# Altium project printer.PrjPCB
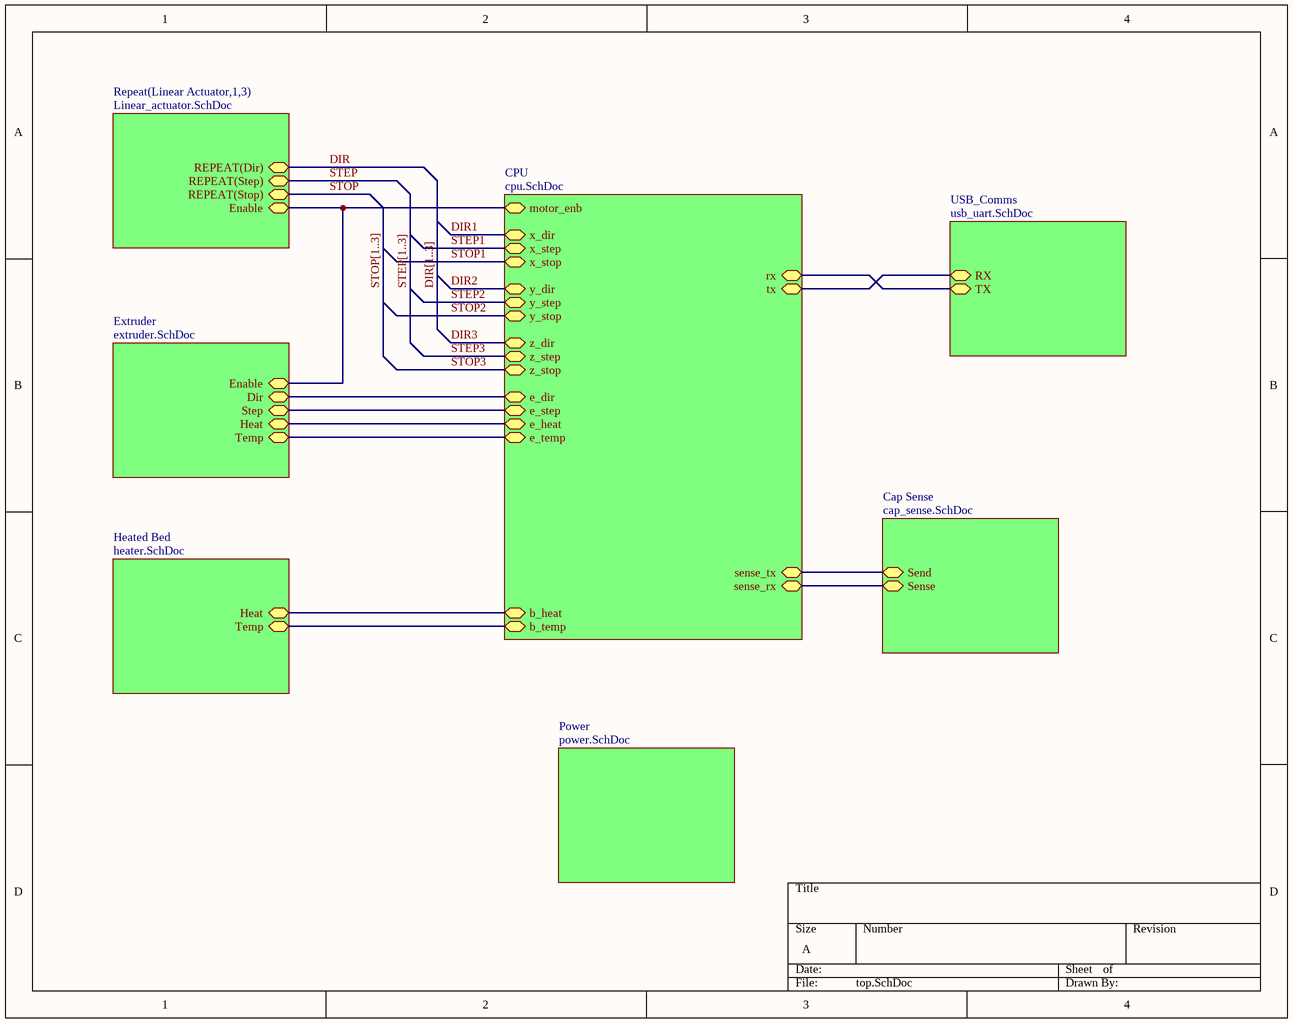
[diagram p0: top.SchDoc]
9 sheets, 136 parts. Net scope: hierarchical (ports join the sheet entries above them; power ports are global).
Board file: pcb.PcbDoc
Sheets:
  top.SchDoc
    CPU = cpu.SchDoc
    Linear Actuator1 = Linear_actuator.SchDoc
      stepper = Stepper_driver.SchDoc
    Linear Actuator2 = Linear_actuator.SchDoc
      stepper = Stepper_driver.SchDoc
    Linear Actuator3 = Linear_actuator.SchDoc
      stepper = Stepper_driver.SchDoc
    Heated Bed = heater.SchDoc
    Extruder = extruder.SchDoc
      stepper = Stepper_driver.SchDoc
      Hot End = heater.SchDoc
    Power = power.SchDoc
    USB_Comms = usb_uart.SchDoc
    Cap Sense = cap_sense.SchDoc

## Sheet top.SchDoc
size A

### Sub-sheets
Cap Sense = cap_sense.SchDoc: Sense, Send
CPU = cpu.SchDoc: x_step, x_dir, motor_enb, y_step, y_dir, z_step, z_dir, e_step, e_dir, e_heat, e_temp, b_heat, b_temp, x_stop, y_stop, z_stop, rx, tx, sense_rx, sense_tx
Extruder = extruder.SchDoc: Dir, Step, Enable, Heat, Temp
Heated Bed = heater.SchDoc: Temp, Heat
Power = power.SchDoc: no entries
Repeat(Linear Actuator,1,3) = Linear_actuator.SchDoc: REPEAT(Dir), REPEAT(Step), Enable, REPEAT(Stop)
USB_Comms = usb_uart.SchDoc: RX, TX

### Nets
DIR: sheet Repeat(Linear Actuator,1,3)/REPEAT(Dir)
STEP: sheet Repeat(Linear Actuator,1,3)/REPEAT(Step)
STOP: sheet Repeat(Linear Actuator,1,3)/REPEAT(Stop)
NetC8_Heated_Bed_1: sheet CPU/b_temp, sheet Heated Bed/Temp
NetC8_Hot_End_1: sheet CPU/e_temp, sheet Extruder/Temp
NetQ2_1: sheet CPU/sense_tx, sheet Cap Sense/Send
NetQ3_2: sheet CPU/sense_rx, sheet Cap Sense/Sense
NetR6_Heated_Bed_2: sheet CPU/b_heat, sheet Heated Bed/Heat
NetR6_Hot_End_2: sheet CPU/e_heat, sheet Extruder/Heat
NetU1_9: sheet CPU/rx, sheet USB_Comms/TX
NetU1_10: sheet CPU/tx, sheet USB_Comms/RX
NetU1_34: sheet CPU/e_step, sheet Extruder/Step
NetU1_35: sheet CPU/motor_enb, sheet Repeat(Linear Actuator,1,3)/Enable, sheet Extruder/Enable
NetU1_36: sheet CPU/e_dir, sheet Extruder/Dir

### Buses and harness runs
bus DIR[1..3]
bus STEP[1..3]
bus STOP[1..3]

## Sheet cpu.SchDoc
size A
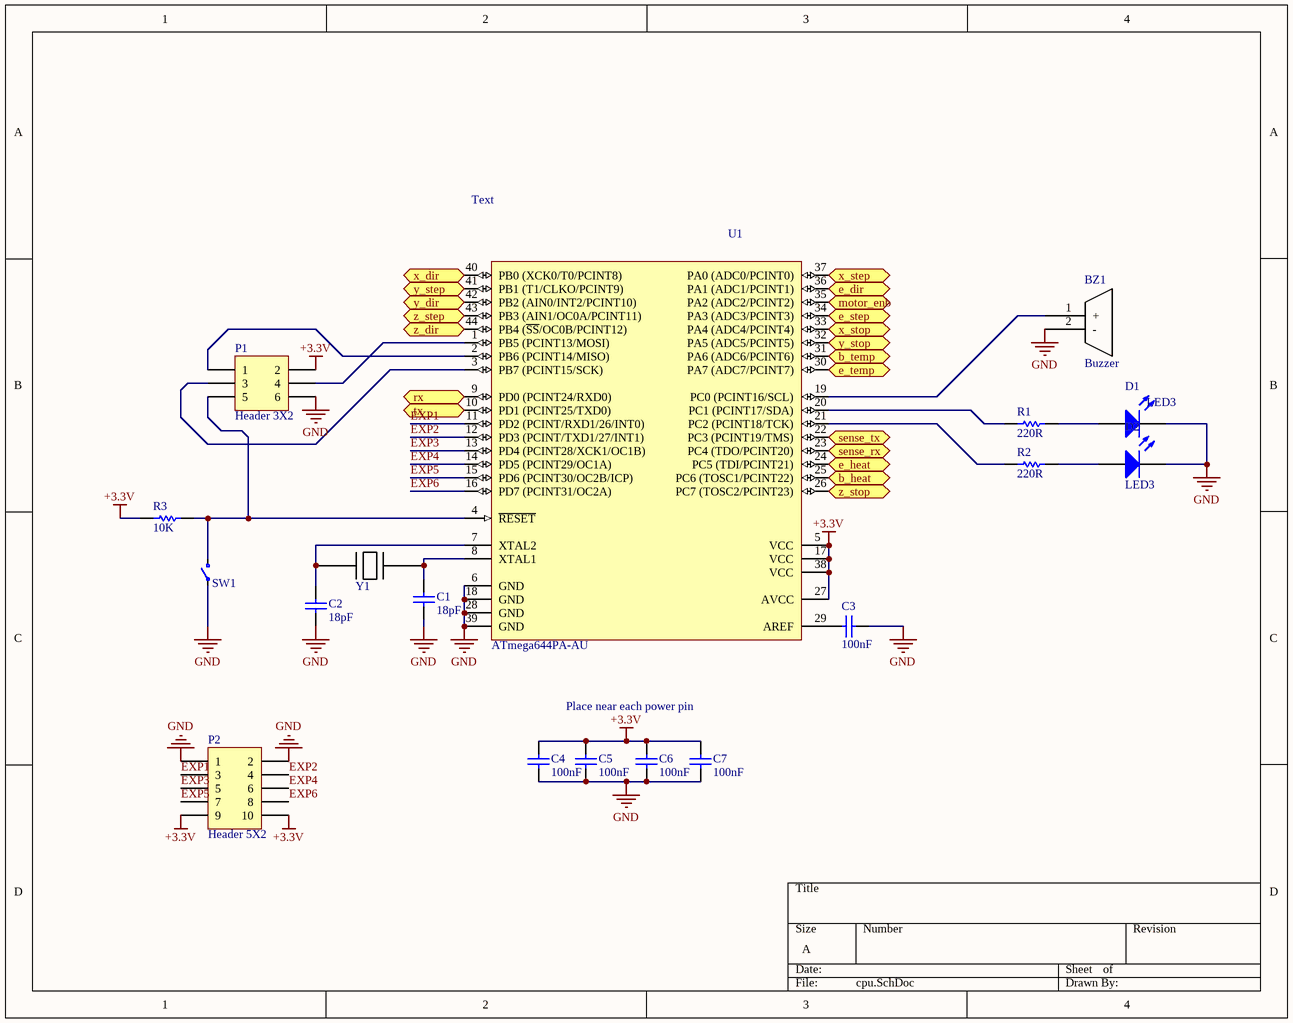
[diagram p1: cpu.SchDoc]

### Parts
BZ1  Buzzer  [buzzer]
C1  value 18pF  [CAPC2012L-3D]  (hidden comment: Cap)
C2  value 18pF  [CAPC2012L-3D]  (hidden comment: Cap)
C3  value 100nF  [1608[0603]]  (hidden comment: Cap)
C4  value 100nF  [1608[0603]]  (hidden comment: Cap)
C5  value 100nF  [1608[0603]]  (hidden comment: Cap)
C6  value 100nF  [1608[0603]]  (hidden comment: Cap)
C7  value 100nF  [1608[0603]]  (hidden comment: Cap)
D1  LED3  [LED 0805]
D2  LED3  [LED 0805]
P1  Header 3X2  [HDR2X3]
P2  Header 5X2  [HDR2X5]
R1  value 220R  [J1-0603]  (hidden comment: Res)
R2  value 220R  [J1-0603]  (hidden comment: Res)
R3  value 10K  [J1-0603]  (hidden comment: Res)
SW1  Tactile Switch 6mm  [Switch 6mm]  (value not drawn)
U1  ATmega644PA-AU  [44A_N]
Y1  ABMM2  [ABMM2]  (value not drawn)

### Ports
b_heat, b_temp, e_dir, e_heat, e_step, e_temp, motor_enb, rx, sense_rx, sense_tx, tx, x_dir, x_step, x_stop, y_dir, y_step, y_stop, z_dir, z_step, z_stop

### Nets
+3.3V: C4.1 C5.1 C6.1 C7.1 P1.2 P2.9 P2.10 R3.2 U1.5(VCC) U1.17(VCC) U1.27(AVCC) U1.38(VCC)
GND: BZ1.2(-) C1.1 C2.1 C3.1 C4.2 C5.2 C6.2 C7.2 D1.2(K) D2.2(K) P1.6 P2.1 P2.2 SW1.1 U1.6(GND) U1.18(GND) U1.28(GND) U1.39(GND) Y1.2 Y1.4
DIR1: U1.40(PB0_(XCK0/T0/PCINT8)) ; port x_dir
DIR2: U1.42(PB2_(AIN0/INT2/PCINT10)) ; port y_dir
DIR3: U1.44(PB4_(~{SS}/OC0B/PCINT12)) ; port z_dir
EXP1: P2.3 U1.11(PD2_(PCINT/RXD1/26/INT0))
EXP2: P2.4 U1.12(PD3_(PCINT/TXD1/27/INT1))
EXP3: P2.5 U1.13(PD4_(PCINT28/XCK1/OC1B))
EXP4: P2.6 U1.14(PD5_(PCINT29/OC1A))
EXP5: P2.7 U1.15(PD6_(PCINT30/OC2B/ICP))
EXP6: P2.8 U1.16(PD7_(PCINT31/OC2A))
STEP1: U1.37(PA0_(ADC0/PCINT0)) ; port x_step
STEP2: U1.41(PB1_(T1/CLKO/PCINT9)) ; port y_step
STEP3: U1.43(PB3_(AIN1/OC0A/PCINT11)) ; port z_step
STOP1: U1.33(PA4_(ADC4/PCINT4)) ; port x_stop
STOP2: U1.32(PA5_(ADC5/PCINT5)) ; port y_stop
STOP3: U1.26(PC7_(TOSC2/PCINT23)) ; port z_stop
NetBZ1_1: BZ1.1(+) U1.19(PC0_(PCINT16/SCL))
NetC1_2: C1.2 U1.8(XTAL1) Y1.3
NetC2_2: C2.2 U1.7(XTAL2) Y1.1
NetC3_2: C3.2 U1.29(AREF)
NetC8_Heated_Bed_1: U1.31(PA6_(ADC6/PCINT6)) ; port b_temp
NetC8_Hot_End_1: U1.30(PA7_(ADC7/PCINT7)) ; port e_temp
NetD1_1: D1.1(A) R1.1
NetD2_1: D2.1(A) R2.1
NetP1_1: P1.1 U1.2(PB6_(PCINT14/MISO))
NetP1_3: P1.3 U1.3(PB7_(PCINT15/SCK))
NetP1_4: P1.4 U1.1(PB5_(PCINT13/MOSI))
NetP1_5: P1.5 R3.1 SW1.2 U1.4(~{RESET})
NetQ2_1: U1.22(PC3_(PCINT19/TMS)) ; port sense_tx
NetQ3_2: U1.23(PC4_(TDO/PCINT20)) ; port sense_rx
NetR1_2: R1.2 U1.20(PC1_(PCINT17/SDA))
NetR2_2: R2.2 U1.21(PC2_(PCINT18/TCK))
NetR6_Heated_Bed_2: U1.25(PC6_(TOSC1/PCINT22)) ; port b_heat
NetR6_Hot_End_2: U1.24(PC5_(TDI/PCINT21)) ; port e_heat
NetU1_9: U1.9(PD0_(PCINT24/RXD0)) ; port rx
NetU1_10: U1.10(PD1_(PCINT25/TXD0)) ; port tx
NetU1_34: U1.34(PA3_(ADC3/PCINT3)) ; port e_step
NetU1_35: U1.35(PA2_(ADC2/PCINT2)) ; port motor_enb
NetU1_36: U1.36(PA1_(ADC1/PCINT1)) ; port e_dir

### Notes on the sheet
- Text
- Place near each power pin

### Library data of the parts
C1-C7 = Cap: Capacitor; Published: 8-Jun-2000; LatestRevisionDate: 17-Jul-2002; LatestRevisionNote: Re-released for DXP Platform.; PackageReference: RAD-0.3; Publisher: Altium Limited; PackageDescription: Radial Cap, Thru-Hole; 2 Leads; 0.3 in Pin Spacing
D1 D2 = LED3: Typical BLUE SiC LED; Published: 8-Jun-2000; LatestRevisionDate: 17-Dec-2003; LatestRevisionNote: PCB Footprint replaced.; DatasheetVersion: 16-Apr-2002; PackageVersion: 16-Apr-2002; PackageReference: 3.5X2.8X1.9; Publisher: Altium Limited; PackageDescription: SM LED; 2 C-Bend Leads; Body 3.5 x 2.8 x 1.9 mm, inc leads (LxWxH typ)
P1 = Header 3X2: Header, 3-Pin, Dual row; LatestRevisionDate: 17-Jul-2002; LatestRevisionNote: Re-released for DXP Platform.; Publisher: Altium Limited
P2 = Header 5X2: Header, 5-Pin, Dual row; LatestRevisionDate: 17-Jul-2002; LatestRevisionNote: Re-released for DXP Platform.; Publisher: Altium Limited
R1-R3 = Res: Resistor 0805; Published: 8-Jun-2000; LatestRevisionDate: 17-Jul-2002; LatestRevisionNote: Re-released for DXP Platform.; PackageReference: AXIAL-0.3; Publisher: Altium Limited; PackageDescription: Axial Device, Thru-Hole; 2 Leads; 0.3 in Pin Spacing
U1 = ATmega644PA-AU: 8-bit AVR Microcontroller, 64KB Flash, 2KB EEPROM, 4KB SRAM, 44-pin TQFP, Industrial Grade (-40°C to 85°C); Published: 1-Apr-2010; DatasheetVersion: revA, Jan-2010; PackageVersion: rev.B, Oct-2001; PackageReference: 44A; Publisher: Altium Limited; PackageDescription: 44-Pin Plastic Thin Profile Quad Flat Pack, 10 x 10 x 1.0 mm Body, 0.8 mm Pitch (TQFP); Supplier 1: Digi-Key; Supplier Part Number 1: ATMEGA644PA-AU-ND; Supplier 2: Mouser; Supplier Part Number 2: 556-ATMEGA644PA-AU; ComponentLink1Description: Manufacturer Link; ComponentLink1URL: http://www.atmel.com/products/avr/default.asp?; ComponentLink2Description: ATmega164A/164PA/324A/324PA/644A/644PA/1284/1284P Datasheet; ComponentLink2URL: http://www.atmel.com/dyn/resources/prod_documents/doc8272.pdf; ComponentLink3Description: ATmega164A/164PA/324A/324PA/644A/644PA/1284/1284P Summary; ComponentLink3URL: http://www.atmel.com/dyn/resources/prod_documents/8272S.pdf; ComponentLink4Description: Atmel.com Home; ComponentLink4URL: http://www.atmel.com

## Sheet Linear_actuator.SchDoc
size A
Used 3 times, as channels Linear Actuator1, Linear Actuator2, Linear Actuator3. Parts and nets are listed once, with the designators drawn on the sheet.
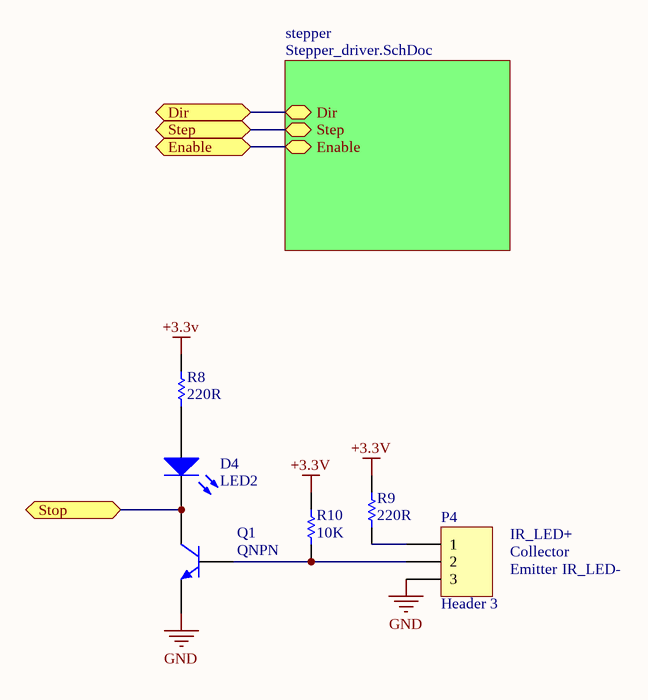
[diagram p2: Linear_actuator.SchDoc]

### Parts
D4  LED2  [LED 0805]
P4  Header 3  [HDR1X3]
Q1  QNPN  [SOT-23B_N]
R8  value 220R  [J1-0603]  (hidden comment: Res)
R9  value 220R  [J1-0603]  (hidden comment: Res)
R10  value 10K  [J1-0603]  (hidden comment: Res)

### Sub-sheets
stepper = Stepper_driver.SchDoc: Dir, Step, Enable

### Ports
Dir, Enable, Step, Stop

### Nets
+3.3V: R8.2 R9.2 R10.2
GND: P4.3 Q1.3(E)
Dir: port Dir, sheet stepper/Dir
Enable: port Enable, sheet stepper/Enable
Step: port Step, sheet stepper/Step
Stop: D4.2(K) Q1.1(C) ; port Stop
NetD4_1: D4.1(A) R8.1
NetP4_1: P4.1 R9.1
NetP4_2: P4.2 Q1.2(B) R10.1

### Channels
Linear Actuator1: designators end in _LinearActuator1; ports Dir=DIR1 Enable=NetU1_35 Step=STEP1 Stop=STOP1
Linear Actuator2: designators end in _LinearActuator2; ports Dir=DIR2 Enable=NetU1_35 Step=STEP2 Stop=STOP2
Linear Actuator3: designators end in _LinearActuator3; ports Dir=DIR3 Enable=NetU1_35 Step=STEP3 Stop=STOP3

### Notes on the sheet
- IR_LED+
- Collector
- Emitter
- IR_LED-

### Library data of the parts
D4 = LED2: Typical RED, GREEN, YELLOW, AMBER GaAs LED; Published: 8-Jun-2000; LatestRevisionDate: 17-Jul-2002; LatestRevisionNote: Re-released for DXP Platform.; PackageVersion: Feb-2002; PackageReference: 3.2X1.6X1.1; Publisher: Altium Limited; PackageDescription: SM LED; 2 Flat Leads
P4 = Header 3: Header, 3-Pin; LatestRevisionDate: 17-Jul-2002; LatestRevisionNote: Re-released for DXP Platform.; Publisher: Altium Limited
Q1 = QNPN: NPN Bipolar Transistor; Published: 8-Jun-2000; LatestRevisionDate: 29-May-2009; LatestRevisionNote: IPC-7351 Footprint Added.; PackageVersion: Aug-1999; PackageReference: SOT-23B; Publisher: Altium Limited; PackageDescription: 3-Pin SOT-23 Package 0.95 mm Pitch, 2.4 mm Lead Span
R8-R10 = Res: Resistor 0805; Published: 8-Jun-2000; LatestRevisionDate: 17-Jul-2002; LatestRevisionNote: Re-released for DXP Platform.; PackageReference: AXIAL-0.3; Publisher: Altium Limited; PackageDescription: Axial Device, Thru-Hole; 2 Leads; 0.3 in Pin Spacing

## Sheet Stepper_driver.SchDoc
size A
Used 4 times, as channels Linear Actuator1/stepper, Linear Actuator2/stepper, Linear Actuator3/stepper, Extruder/stepper. Parts and nets are listed once, with the designators drawn on the sheet.
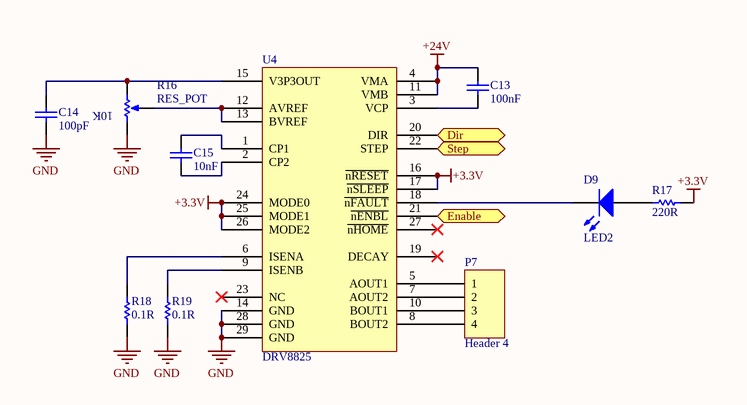
[diagram p3: Stepper_driver.SchDoc]

### Parts
C13  value 100nF  [1608[0603]]  (hidden comment: Cap)
C14  value 100pF  [1608[0603]]  (hidden comment: Cap)
C15  value 10nF  [1608[0603]]  (hidden comment: Cap)
D9  LED2  [LED 0805]
P7  Header 4  [HDR1X4]
R16  RES_POT  [RES_SMD]
R17  value 220R  [J1-0603]  (hidden comment: Res)
R18  value 0.1R  [C1206]  (hidden comment: Res)
R19  value 0.1R  [C1206]  (hidden comment: Res)
U4  DRV8825  [DVR]

### Ports
Dir, Enable, Step

### Nets
+3.3V: R17.2 U4.16(~{nRESET}) U4.17(~{nSLEEP}) U4.24(MODE0) U4.25(MODE1) U4.26(MODE2)
+24V: C13.2 U4.4(VMA) U4.11(VMB)
GND: C14.2 R16.1(TOP) R18.1 R19.1 U4.14(GND) U4.28(GND) U4.29(GND)
Dir: U4.20(DIR) ; port Dir
Enable: U4.21(~{nENBL}) ; port Enable
Step: U4.22(STEP) ; port Step
NetC13_1: C13.1 U4.3(VCP)
NetC14_1: C14.1 R16.2(BOT) U4.15(V3P3OUT)
NetC15_1: C15.1 U4.2(CP2)
NetC15_2: C15.2 U4.1(CP1)
NetD9_1: D9.1(A) R17.1
NetD9_2: D9.2(K) U4.18(~{nFAULT})
NetP7_1: P7.1 U4.5(AOUT1)
NetP7_2: P7.2 U4.7(AOUT2)
NetP7_3: P7.3 U4.10(BOUT1)
NetP7_4: P7.4 U4.8(BOUT2)
NetR16_3: R16.3(TAP) U4.12(AVREF) U4.13(BVREF)
NetR18_2: R18.2 U4.6(ISENA)
NetR19_2: R19.2 U4.9(ISENB)

Not connected (* = marked no-connect by the designer): U4 19(DECAY)* 23(NC)* 27(~{nHOME})*

### Channels
Linear Actuator1/stepper: designators end in _stepper2; ports Dir=DIR1 Enable=NetU1_35 Step=STEP1
Linear Actuator2/stepper: designators end in _stepper3; ports Dir=DIR2 Enable=NetU1_35 Step=STEP2
Linear Actuator3/stepper: designators end in _stepper4; ports Dir=DIR3 Enable=NetU1_35 Step=STEP3
Extruder/stepper: designators end in _stepper1; ports Dir=NetU1_36 Enable=NetU1_35 Step=NetU1_34

### Notes on the sheet
- (in symbol RES_POT) 10K

### Library data of the parts
C13-C15 = Cap: Capacitor; Published: 8-Jun-2000; LatestRevisionDate: 17-Jul-2002; LatestRevisionNote: Re-released for DXP Platform.; PackageReference: RAD-0.3; Publisher: Altium Limited; PackageDescription: Radial Cap, Thru-Hole; 2 Leads; 0.3 in Pin Spacing
D9 = LED2: as D4 on sheet Linear_actuator; Published: 8-Jun-2000; LatestRevisionDate: 17-Jul-2002; LatestRevisionNote: Re-released for DXP Platform.; PackageVersion: Feb-2002; PackageReference: 3.2X1.6X1.1; Publisher: Altium Limited; PackageDescription: SM LED; 2 Flat Leads
P7 = Header 4: Header, 4-Pin; LatestRevisionDate: 17-Jul-2002; LatestRevisionNote: Re-released for DXP Platform.; Publisher: Altium Limited
R17-R19 = Res: Resistor 0805; Published: 8-Jun-2000; LatestRevisionDate: 17-Jul-2002; LatestRevisionNote: Re-released for DXP Platform.; PackageReference: AXIAL-0.3; Publisher: Altium Limited; PackageDescription: Axial Device, Thru-Hole; 2 Leads; 0.3 in Pin Spacing

## Sheet heater.SchDoc
size A
Used 2 times, as channels Heated Bed, Extruder/Hot End. Parts and nets are listed once, with the designators drawn on the sheet.
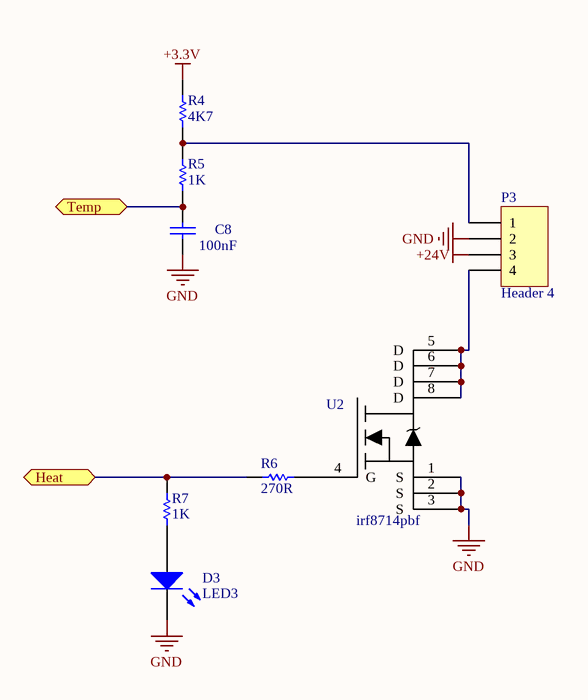
[diagram p4: heater.SchDoc]

### Parts
C8  value 100nF  [1608[0603]]  (hidden comment: Cap)
D3  LED3  [LED 0805]
P3  Header 4  [HDR1X4]
R4  value 4K7  [J1-0603]  (hidden comment: Res)
R5  value 1K  [J1-0603]  (hidden comment: Res)
R6  value 270R  [J1-0603]  (hidden comment: Res)
R7  value 1K  [J1-0603]  (hidden comment: Res)
U2  irf8714pbf  [SO-8_M]

### Ports
Heat, Temp

### Nets
+3.3V: R4.2
+24V: P3.3
GND: C8.2 D3.2(K) P3.2 U2.1(S) U2.2(S) U2.3(S)
Heat: R6.2 R7.2 ; port Heat
Temp: C8.1 R5.1 ; port Temp
NetD3_1: D3.1(A) R7.1
NetP3_1: P3.1 R4.1 R5.2
NetP3_4: P3.4 U2.5(D) U2.6(D) U2.7(D) U2.8(D)
NetR6_1: R6.1 U2.4(G)

### Channels
Heated Bed: designators end in _Heated_Bed; ports Heat=NetR6_Heated_Bed_2 Temp=NetC8_Heated_Bed_1
Extruder/Hot End: designators end in _Hot_End; ports Heat=NetR6_Hot_End_2 Temp=NetC8_Hot_End_1

### Library data of the parts
C8 = Cap: Capacitor; Published: 8-Jun-2000; LatestRevisionDate: 17-Jul-2002; LatestRevisionNote: Re-released for DXP Platform.; PackageReference: RAD-0.3; Publisher: Altium Limited; PackageDescription: Radial Cap, Thru-Hole; 2 Leads; 0.3 in Pin Spacing
D3 = LED3: Typical BLUE SiC LED; Published: 8-Jun-2000; LatestRevisionDate: 17-Dec-2003; LatestRevisionNote: PCB Footprint replaced.; DatasheetVersion: 16-Apr-2002; PackageVersion: 16-Apr-2002; PackageReference: 3.5X2.8X1.9; Publisher: Altium Limited; PackageDescription: SM LED; 2 C-Bend Leads; Body 3.5 x 2.8 x 1.9 mm, inc leads (LxWxH typ)
P3 = Header 4: Header, 4-Pin; LatestRevisionDate: 17-Jul-2002; LatestRevisionNote: Re-released for DXP Platform.; Publisher: Altium Limited
R4-R7 = Res: Resistor 0805; Published: 8-Jun-2000; LatestRevisionDate: 17-Jul-2002; LatestRevisionNote: Re-released for DXP Platform.; PackageReference: AXIAL-0.3; Publisher: Altium Limited; PackageDescription: Axial Device, Thru-Hole; 2 Leads; 0.3 in Pin Spacing

## Sheet extruder.SchDoc
size A
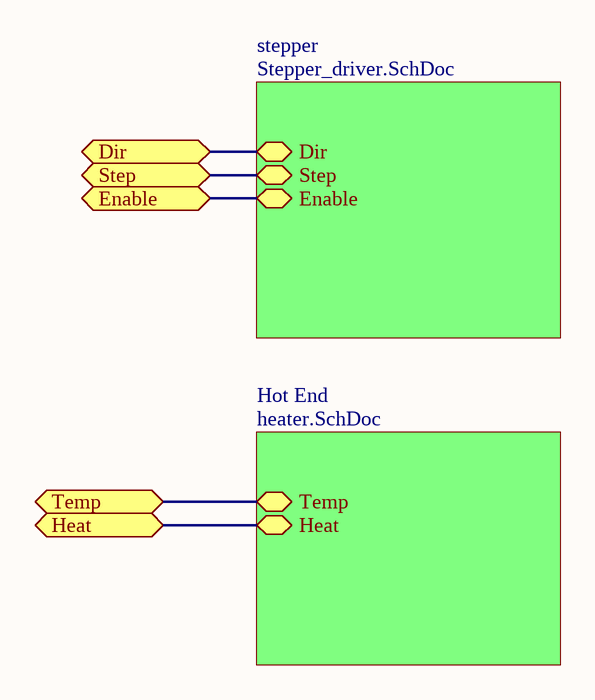
[diagram p5: extruder.SchDoc]

### Sub-sheets
Hot End = heater.SchDoc: Temp, Heat
stepper = Stepper_driver.SchDoc: Dir, Step, Enable

### Ports
Dir, Enable, Heat, Step, Temp

### Nets
NetC8_Hot_End_1: port Temp, sheet Hot End/Temp
NetR6_Hot_End_2: port Heat, sheet Hot End/Heat
NetU1_34: port Step, sheet stepper/Step
NetU1_35: port Enable, sheet stepper/Enable
NetU1_36: port Dir, sheet stepper/Dir

## Sheet power.SchDoc
size A
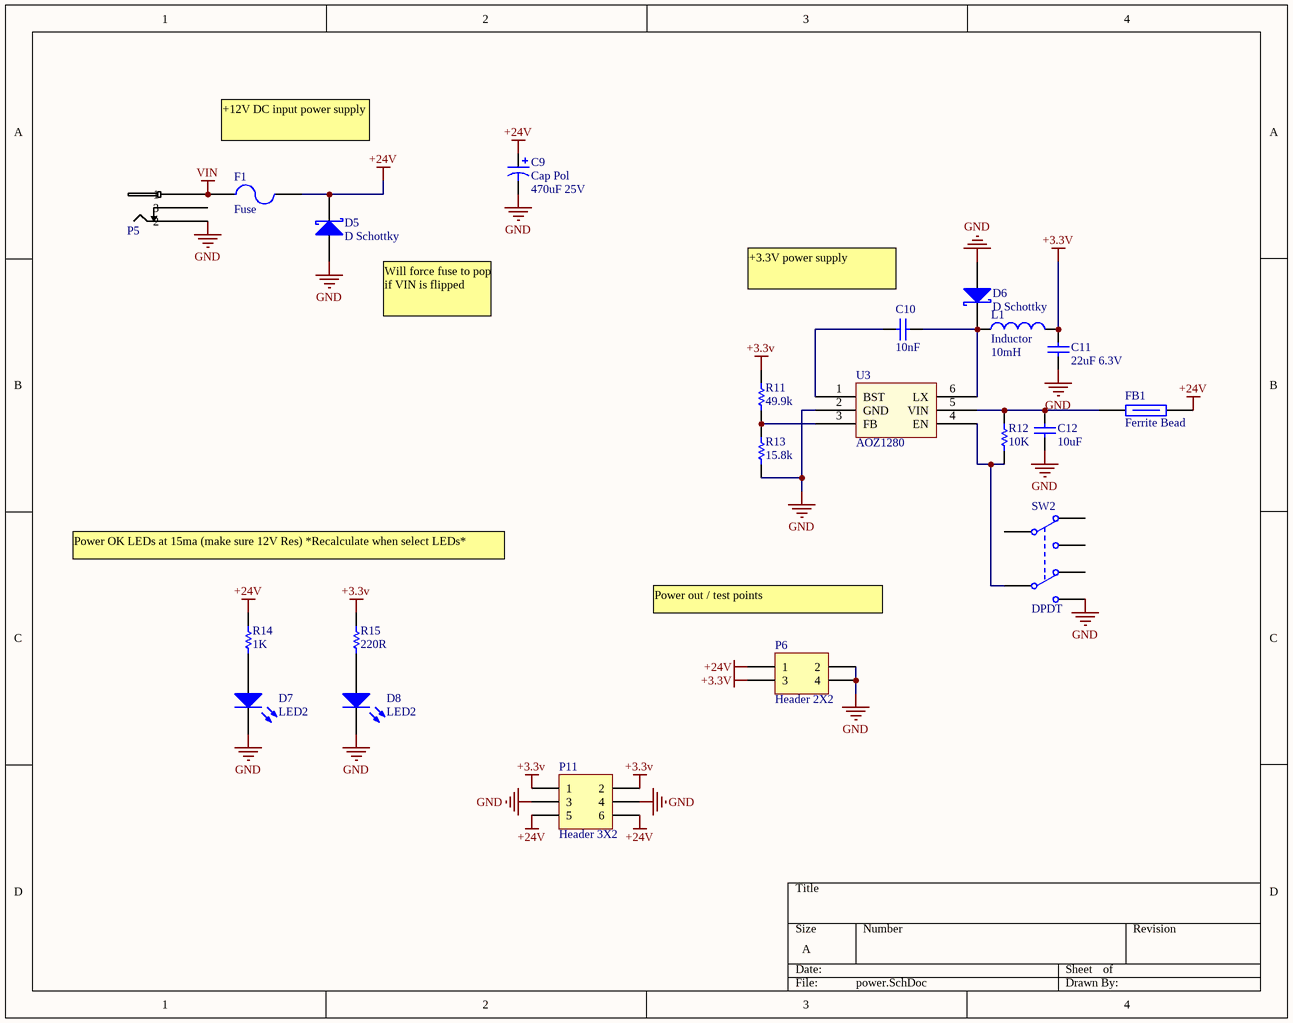
[diagram p6: power.SchDoc]

### Parts
C9  Cap Pol  value 470uF 25V  [Capacitor Nichi CL 10x10]
C10  value 10nF  [1608[0603]]  (hidden comment: Cap)
C11  value 22uF 6.3V  [CAPC2012L-3D]  (hidden comment: Cap)
C12  value 10uF  [CAPC2012L-3D]  (hidden comment: Cap)
D5  D Schottky  [DO-214-AA]
D6  D Schottky  [DO-214-AA]
D7  LED2  [LED 0805]
D8  LED2  [LED 0805]
F1  Fuse  [Fuse Holder]
FB1  Ferrite Bead  [0603]
L1  Inductor  value 10mH  [Inductor 5020]
P5  power_jack  [PowerJack]  (value not drawn)
P6  Header 2X2  [HDR2X2]
P11  Header 3X2  [HDR2X3]
R11  value 49.9k  [J1-0603]  (hidden comment: Res)
R12  value 10K  [J1-0603]  (hidden comment: Res)
R13  value 15.8k  [J1-0603]  (hidden comment: Res)
R14  value 1K  [J1-0603]  (hidden comment: Res)
R15  value 220R  [J1-0603]  (hidden comment: Res)
SW2  DPDT  [MCLSS22]
U3  AOZ1280  [SOT23-6]

### Nets
+3.3V: C11.2 L1.2 P6.3 P11.1 P11.2 R11.2 R15.2
+24V: C9.2 D5.2(K) F1.2 FB1.2 P6.1 P11.5 P11.6 R14.2
GND: C9.1 C11.1 C12.1 D5.1(A) D6.1(A) D7.2(K) D8.2(K) P5.2 P6.2 P6.4 P11.3 P11.4 R13.1 SW2.6(NO2) U3.2(GND)
VIN: F1.1 P5.1
NetC10_1: C10.1 U3.1(BST)
NetC10_2: C10.2 D6.2(K) L1.1 U3.6(LX)
NetC12_2: C12.2 FB1.1 R12.2 U3.5(VIN)
NetD7_1: D7.1(A) R14.1
NetD8_1: D8.1(A) R15.1
NetR11_1: R11.1 R13.2 U3.3(FB)
NetR12_1: R12.1 SW2.5(COMMON2) U3.4(EN)

Not connected (* = marked no-connect by the designer): P5 3; SW2 1(NC1) 2(COMMON1) 3(NO1) 4(NC2)

### Notes on the sheet
- +12V DC input power supply
- (near C10) +3.3V power supply
- Will force fuse to pop if VIN is flipped
- Power OK LEDs at 15ma (make sure 12V Res) *Recalculate when select LEDs*
- Power out / test points

### Library data of the parts
C9 = Cap Pol: Polarized Capacitor (Axial); Published: 8-Jun-2000; LatestRevisionDate: 17-Jul-2002; LatestRevisionNote: Re-released for DXP Platform.; PackageReference: POLAR0.8; Publisher: Altium Limited; PackageDescription: Polarized Capacitor; 2 Leads
C10-C12 = Cap: Capacitor; Published: 8-Jun-2000; LatestRevisionDate: 17-Jul-2002; LatestRevisionNote: Re-released for DXP Platform.; PackageReference: RAD-0.3; Publisher: Altium Limited; PackageDescription: Radial Cap, Thru-Hole; 2 Leads; 0.3 in Pin Spacing
D5 D6 = D Schottky: Schottky Diode; Published: 8-Jun-2000; LatestRevisionDate: 17-Jul-2002; LatestRevisionNote: Re-released for DXP Platform.; PackageReference: SMB; Publisher: Altium Limited; PackageDescription: DO-214-AA/SMB; 2 C-Bend Leads; Body 5.3 x 3.6 mm, inc. leads (LxW); Code_JEDEC: DO-214-AA
D7 D8 = LED2: as D4 on sheet Linear_actuator; Published: 8-Jun-2000; LatestRevisionDate: 17-Jul-2002; LatestRevisionNote: Re-released for DXP Platform.; PackageVersion: Feb-2002; PackageReference: 3.2X1.6X1.1; Publisher: Altium Limited; PackageDescription: SM LED; 2 Flat Leads
L1 = Inductor: Code_IEC: 1005; Published: 8-Jun-2000; LatestRevisionDate: 29-May-2009; LatestRevisionNote: IPC-7351 Footprint Added.; PackageReference: 0402-A; Publisher: Altium Limited; PackageDescription: Chip Inductor; Code_JEITA: 0402
P6 = Header 2X2: Header, 2-Pin, Dual row; LatestRevisionDate: 17-Jul-2002; LatestRevisionNote: Re-released for DXP Platform.; Publisher: Altium Limited
P11 = Header 3X2: Header, 3-Pin, Dual row; LatestRevisionDate: 17-Jul-2002; LatestRevisionNote: Re-released for DXP Platform.; Publisher: Altium Limited
R11-R15 = Res: Resistor 0805; Published: 8-Jun-2000; LatestRevisionDate: 17-Jul-2002; LatestRevisionNote: Re-released for DXP Platform.; PackageReference: AXIAL-0.3; Publisher: Altium Limited; PackageDescription: Axial Device, Thru-Hole; 2 Leads; 0.3 in Pin Spacing
SW2 = DPDT: Switch; Published: 24-Mar-1999; LatestRevisionDate: 29-May-2009; LatestRevisionNote: IPC-7351 Footprint Added.; PackageVersion: Mar-2001; PackageReference: SOT23-6; Publisher: Altium Limited; PackageDescription: 6-Pin SOT-23 Package 0.95 mm Pitch, 2.7 mm Lead Span; Code_JEITA: SC-74; Code_IPC: SOT26A-6
F1 = Fuse: Published: 8-Jun-2000; LatestRevisionDate: 17-Jul-2002; LatestRevisionNote: Re-released for DXP Platform.; PackageReference: PIN-W2/E2.8; Publisher: Altium Limited; PackageDescription: Thru-Hole; 2 Leads

## Sheet usb_uart.SchDoc
size A
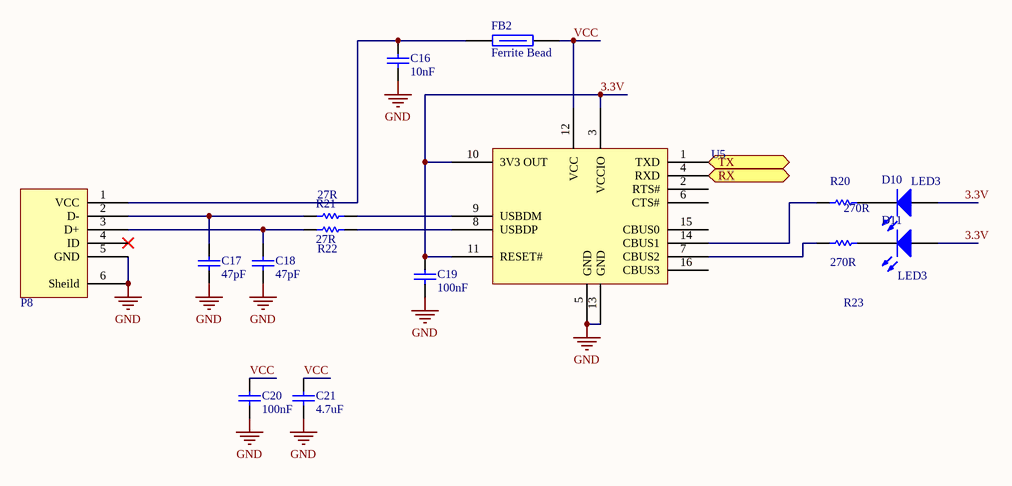
[diagram p7: usb_uart.SchDoc]

### Parts
C16  value 10nF  [1608[0603]]  (hidden comment: Cap)
C17  value 47pF  [1608[0603]]  (hidden comment: Cap)
C18  value 47pF  [1608[0603]]  (hidden comment: Cap)
C19  value 100nF  [1608[0603]]  (hidden comment: Cap)
C20  value 100nF  [1608[0603]]  (hidden comment: Cap)
C21  value 4.7uF  [1608[0603]]  (hidden comment: Cap)
D10  LED3  [LED 0805]
D11  LED3  [LED 0805]
FB2  Ferrite Bead  [0603]
P8  USB Micro B  [USB micro B]  (value not drawn)
R20  value 270R  [J1-0603]  (hidden comment: Res)
R21  value 27R  [J1-0603]  (hidden comment: Res)
R22  value 27R  [J1-0603]  (hidden comment: Res)
R23  value 270R  [J1-0603]  (hidden comment: Res)
U5  FT230XS  [SSOP16_N]  (value not drawn)

### Ports
RX, TX

### Nets
GND: C16.1 C17.1 C18.1 C19.1 C20.1 C21.1 P8.5(GND) P8.6(Sheild) U5.5(GND) U5.13(GND)
3.3V: C19.2 D10.1(A) D11.1(A) U5.3(VCCIO) U5.10(3V3_OUT) U5.11(RESET#)
VCC: C20.2 C21.2 FB2.1 U5.12(VCC)
NetC16_2: C16.2 FB2.2 P8.1(VCC)
NetC17_2: C17.2 P8.2(D-) R21.2
NetC18_2: C18.2 P8.3(D+) R22.2
NetD10_2: D10.2(K) R20.1
NetD11_2: D11.2(K) R23.1
NetR20_2: R20.2 U5.14(CBUS1)
NetR21_1: R21.1 U5.9(USBDM)
NetR22_1: R22.1 U5.8(USBDP)
NetR23_2: R23.2 U5.7(CBUS2)
NetU1_9: U5.1(TXD) ; port TX
NetU1_10: U5.4(RXD) ; port RX

Not connected (* = marked no-connect by the designer): P8 4(ID)*; U5 2(RTS#) 6(CTS#) 15(CBUS0) 16(CBUS3)

### Library data of the parts
C16-C21 = Cap: Capacitor; Published: 8-Jun-2000; LatestRevisionDate: 17-Jul-2002; LatestRevisionNote: Re-released for DXP Platform.; PackageReference: RAD-0.3; Publisher: Altium Limited; PackageDescription: Radial Cap, Thru-Hole; 2 Leads; 0.3 in Pin Spacing
D10 D11 = LED3: Typical BLUE SiC LED; Published: 8-Jun-2000; LatestRevisionDate: 17-Dec-2003; LatestRevisionNote: PCB Footprint replaced.; DatasheetVersion: 16-Apr-2002; PackageVersion: 16-Apr-2002; PackageReference: 3.5X2.8X1.9; Publisher: Altium Limited; PackageDescription: SM LED; 2 C-Bend Leads; Body 3.5 x 2.8 x 1.9 mm, inc leads (LxWxH typ)
R20-R23 = Res: Resistor 0805; Published: 8-Jun-2000; LatestRevisionDate: 17-Jul-2002; LatestRevisionNote: Re-released for DXP Platform.; PackageReference: AXIAL-0.3; Publisher: Altium Limited; PackageDescription: Axial Device, Thru-Hole; 2 Leads; 0.3 in Pin Spacing

## Sheet cap_sense.SchDoc
size A
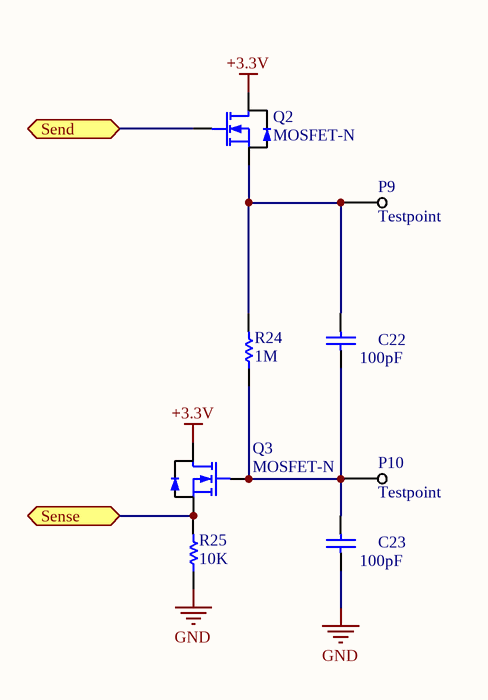
[diagram p8: cap_sense.SchDoc]

### Parts
C22  value 100pF  [1608[0603]]  (hidden comment: Cap)
C23  value 100pF  [1608[0603]]  (hidden comment: Cap)
P9  Testpoint  [Testpoint]
P10  Testpoint  [Testpoint]
Q2  MOSFET-N  [SOT23]
Q3  MOSFET-N  [SOT23]
R24  value 1M  [J1-0603]  (hidden comment: Res)
R25  value 10K  [J1-0603]  (hidden comment: Res)

### Ports
Send, Sense

### Nets
+3.3V: Q2.3(D) Q3.3(D)
GND: C23.2 R25.1
NetC22_1: C22.1 P9.1 Q2.2(S) R24.2
NetC22_2: C22.2 C23.1 P10.1 Q3.1(G) R24.1
NetQ2_1: Q2.1(G) ; port Send
NetQ3_2: Q3.2(S) R25.2 ; port Sense

### Library data of the parts
C22 C23 = Cap: Capacitor; Published: 8-Jun-2000; LatestRevisionDate: 17-Jul-2002; LatestRevisionNote: Re-released for DXP Platform.; PackageReference: RAD-0.3; Publisher: Altium Limited; PackageDescription: Radial Cap, Thru-Hole; 2 Leads; 0.3 in Pin Spacing
Q2 Q3 = MOSFET-N: N-Channel MOSFET; Published: 8-Jun-2000; LatestRevisionDate: 17-Jul-2002; LatestRevisionNote: Re-released for DXP Platform.; PackageVersion: 1995/1996; PackageReference: E3; Publisher: Altium Limited; PackageDescription: TO, Flat Index; 3 In-Line, Axial Leads; Body Dia. 4.6mm; Lead Dia. 0.5 mm (max)
R24 R25 = Res: Resistor 0805; Published: 8-Jun-2000; LatestRevisionDate: 17-Jul-2002; LatestRevisionNote: Re-released for DXP Platform.; PackageReference: AXIAL-0.3; Publisher: Altium Limited; PackageDescription: Axial Device, Thru-Hole; 2 Leads; 0.3 in Pin Spacing

## Nets that join several sheets
+3.3V: cpu (12 pins), Linear Actuator1 (R8_LinearActuator1.2 R9_LinearActuator1.2 R10_LinearActuator1.2), Linear Actuator1/stepper (6 pins), Linear Actuator2 (R8_LinearActuator2.2 R9_LinearActuator2.2 R10_LinearActuator2.2), Linear Actuator2/stepper (6 pins), Linear Actuator3 (R8_LinearActuator3.2 R9_LinearActuator3.2 R10_LinearActuator3.2), Linear Actuator3/stepper (6 pins), Heated Bed (R4_Heated_Bed.2), Extruder/stepper (6 pins), Extruder/Hot End (R4_Hot_End.2), power (7 pins), cap_sense (Q2.3 Q3.3)
+24V: Linear Actuator1/stepper (C13_stepper2.2 U4_stepper2.4 U4_stepper2.11), Linear Actuator2/stepper (C13_stepper3.2 U4_stepper3.4 U4_stepper3.11), Linear Actuator3/stepper (C13_stepper4.2 U4_stepper4.4 U4_stepper4.11), Heated Bed (P3_Heated_Bed.3), Extruder/stepper (C13_stepper1.2 U4_stepper1.4 U4_stepper1.11), Extruder/Hot End (P3_Hot_End.3), power (8 pins)
GND: cpu (20 pins), Linear Actuator1 (P4_LinearActuator1.3 Q1_LinearActuator1.3), Linear Actuator1/stepper (7 pins), Linear Actuator2 (P4_LinearActuator2.3 Q1_LinearActuator2.3), Linear Actuator2/stepper (7 pins), Linear Actuator3 (P4_LinearActuator3.3 Q1_LinearActuator3.3), Linear Actuator3/stepper (7 pins), Heated Bed (6 pins), Extruder/stepper (7 pins), Extruder/Hot End (6 pins), power (15 pins), usb_uart (10 pins), cap_sense (C23.2 R25.1)
DIR1: cpu (U1.40), Linear Actuator1/stepper (U4_stepper2.20)
DIR2: cpu (U1.42), Linear Actuator2/stepper (U4_stepper3.20)
DIR3: cpu (U1.44), Linear Actuator3/stepper (U4_stepper4.20)
NetC8_Heated_Bed_1: cpu (U1.31), Heated Bed (C8_Heated_Bed.1 R5_Heated_Bed.1)
NetC8_Hot_End_1: cpu (U1.30), Extruder/Hot End (C8_Hot_End.1 R5_Hot_End.1)
NetQ2_1: cpu (U1.22), cap_sense (Q2.1)
NetQ3_2: cpu (U1.23), cap_sense (Q3.2 R25.2)
NetR6_Heated_Bed_2: cpu (U1.25), Heated Bed (R6_Heated_Bed.2 R7_Heated_Bed.2)
NetR6_Hot_End_2: cpu (U1.24), Extruder/Hot End (R6_Hot_End.2 R7_Hot_End.2)
NetU1_9: cpu (U1.9), usb_uart (U5.1)
NetU1_10: cpu (U1.10), usb_uart (U5.4)
NetU1_34: cpu (U1.34), Extruder/stepper (U4_stepper1.22)
NetU1_35: cpu (U1.35), Linear Actuator1/stepper (U4_stepper2.21), Linear Actuator2/stepper (U4_stepper3.21), Linear Actuator3/stepper (U4_stepper4.21), Extruder/stepper (U4_stepper1.21)
NetU1_36: cpu (U1.36), Extruder/stepper (U4_stepper1.20)
STEP1: cpu (U1.37), Linear Actuator1/stepper (U4_stepper2.22)
STEP2: cpu (U1.41), Linear Actuator2/stepper (U4_stepper3.22)
STEP3: cpu (U1.43), Linear Actuator3/stepper (U4_stepper4.22)
STOP1: cpu (U1.33), Linear Actuator1 (D4_LinearActuator1.2 Q1_LinearActuator1.1)
STOP2: cpu (U1.32), Linear Actuator2 (D4_LinearActuator2.2 Q1_LinearActuator2.1)
STOP3: cpu (U1.26), Linear Actuator3 (D4_LinearActuator3.2 Q1_LinearActuator3.1)